# EasyEDA Pro project Lib.epro

# Board 提取库
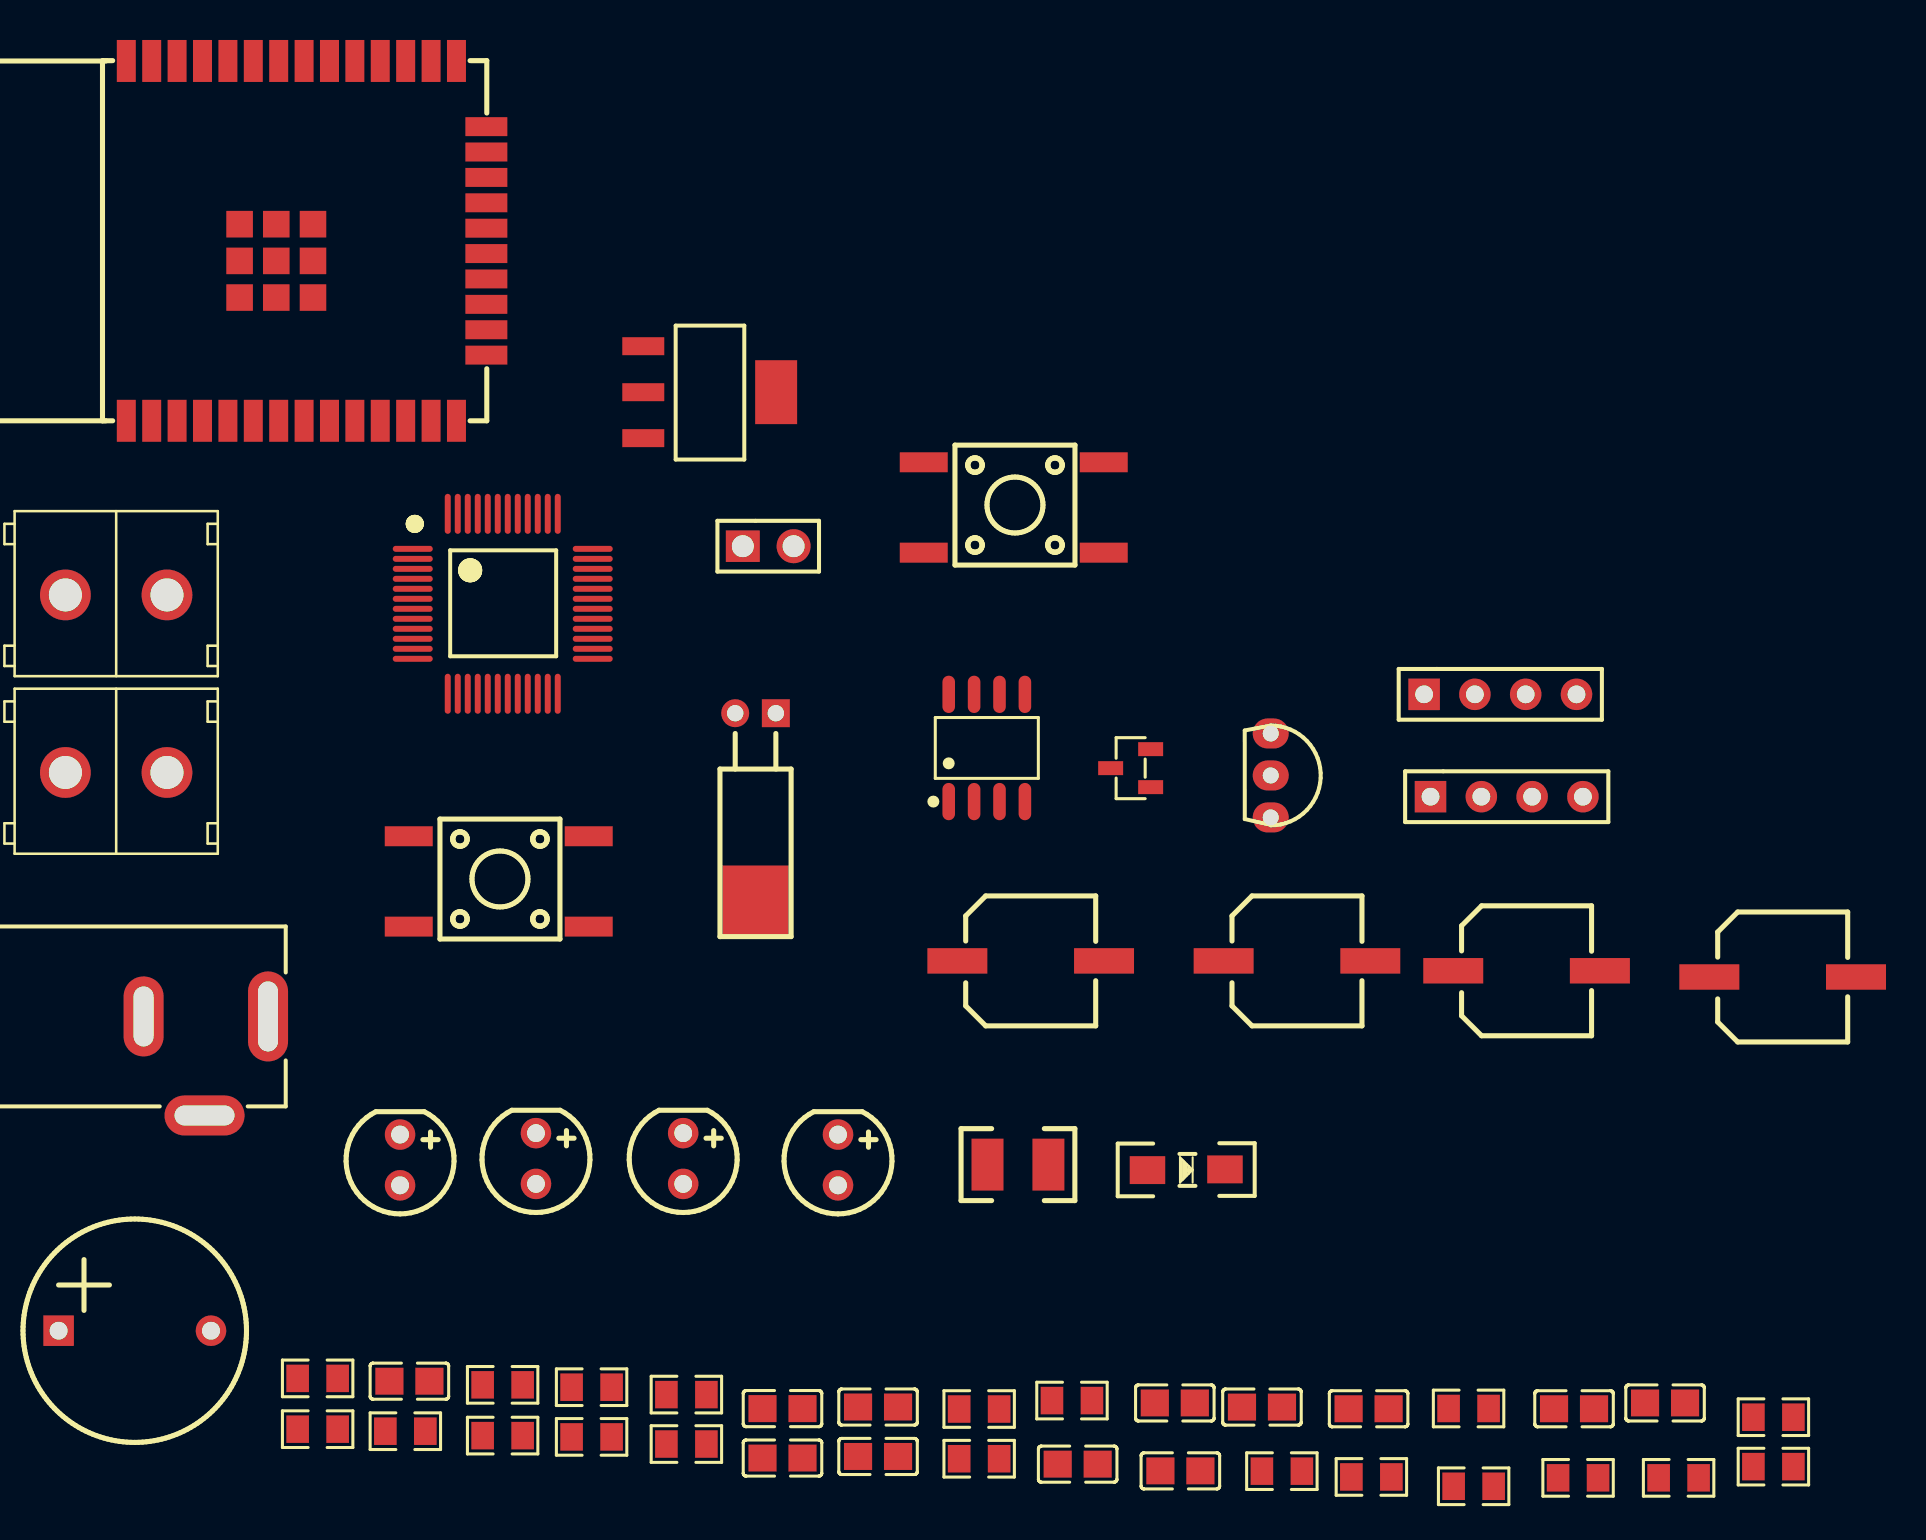
[diagram p0: board, top side]
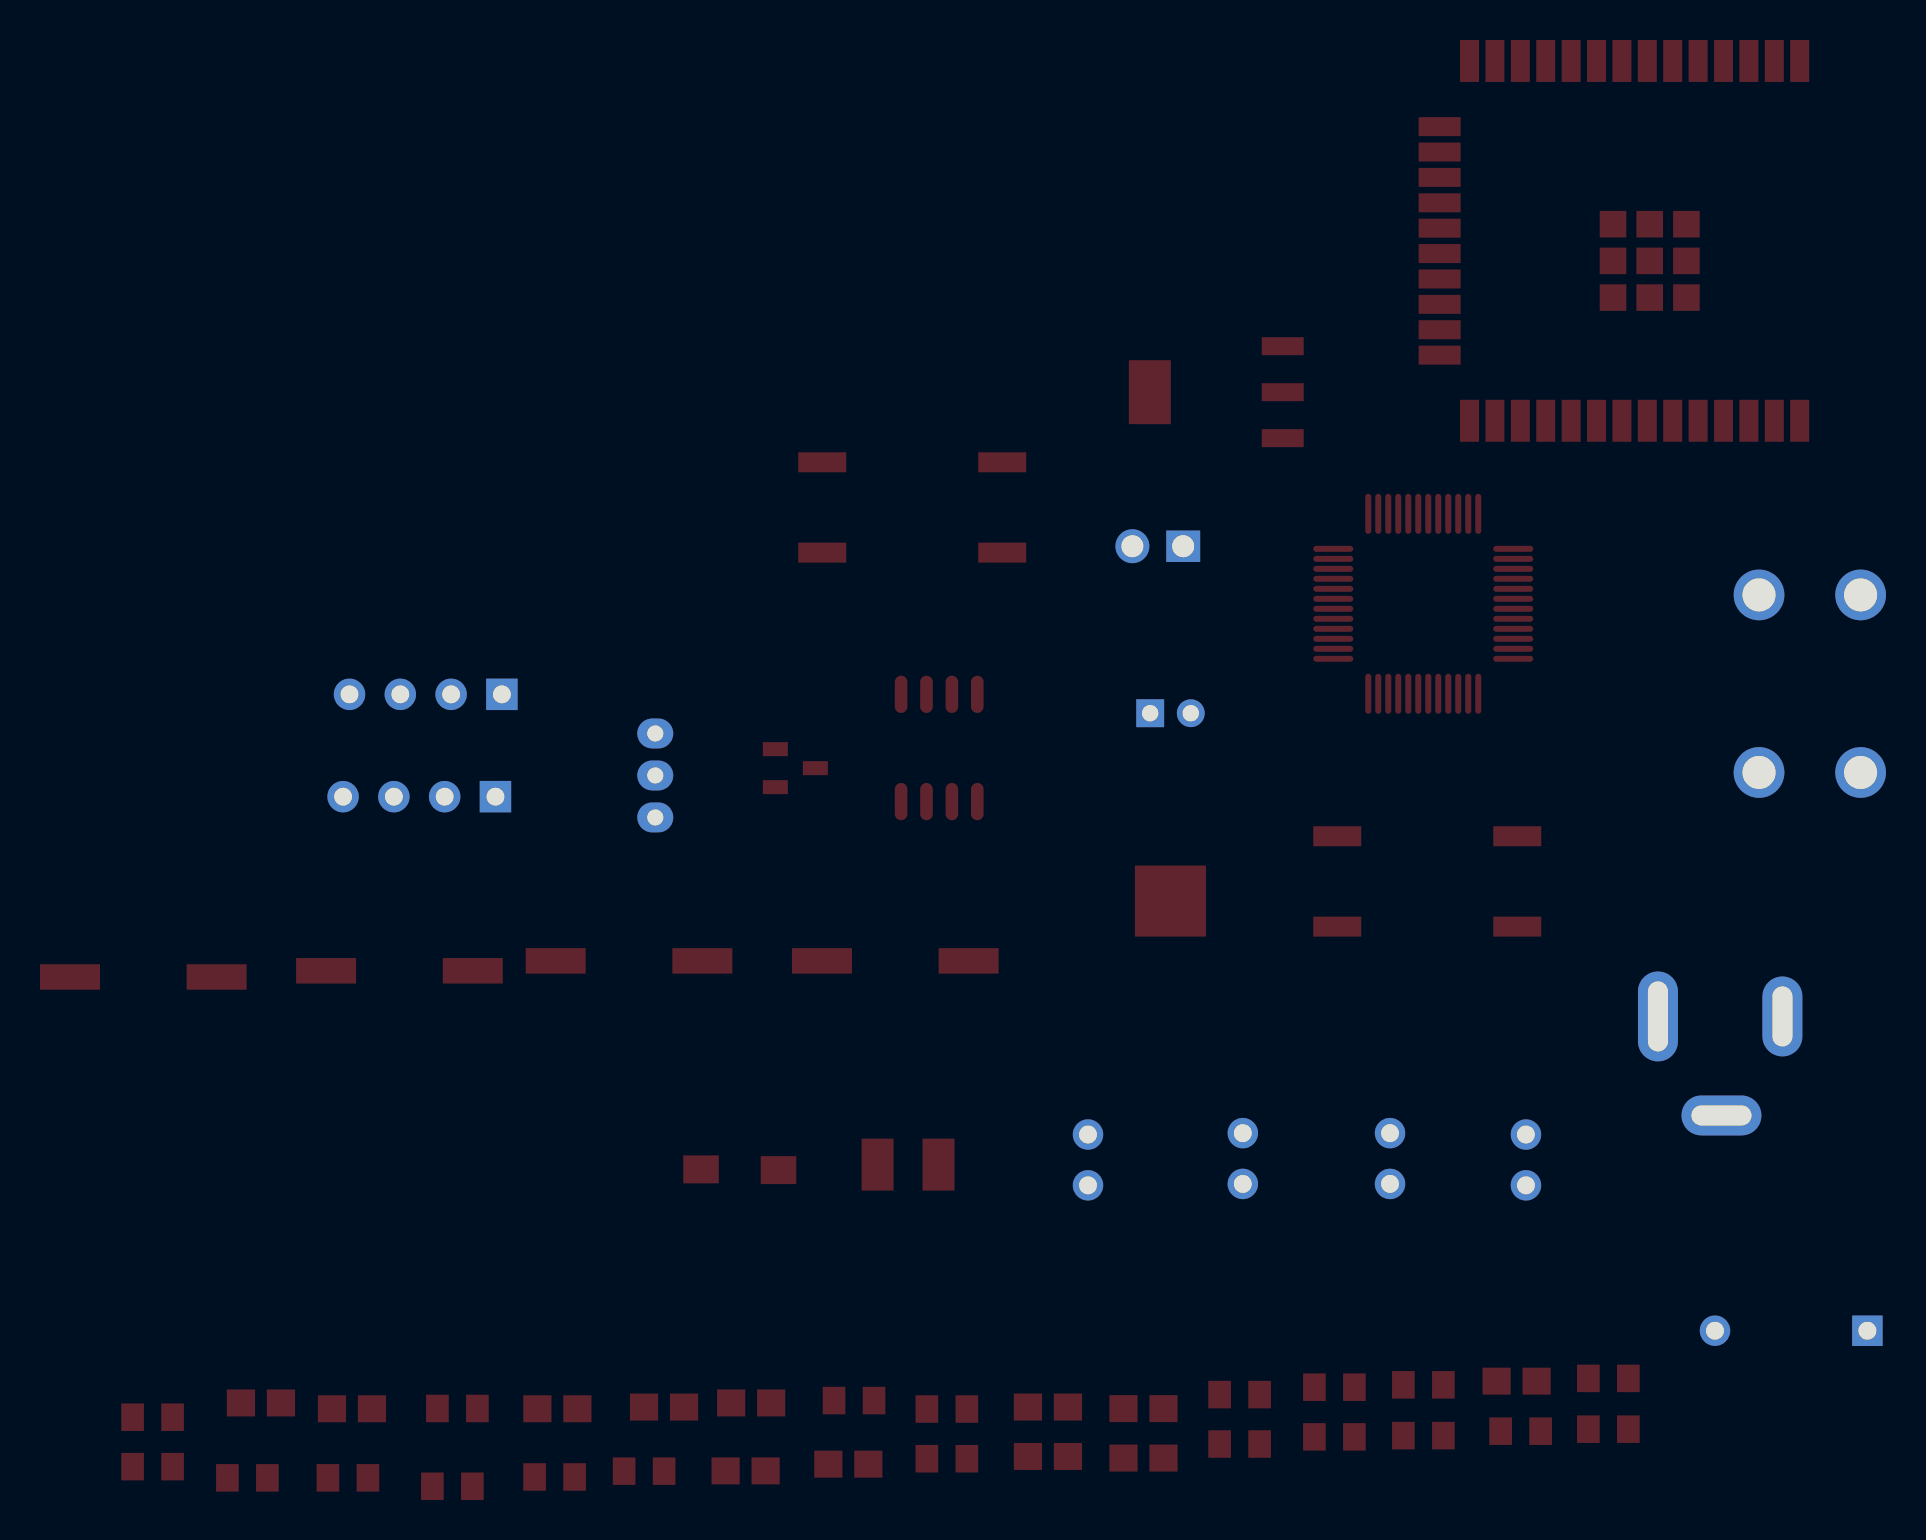
[diagram p1: board, bottom side, seen from below]

No outline. copper layers: Top Layer, Bottom Layer. Coordinates in mm from the lowest, leftmost part position.
Stack: Top Layer 0.035mm / Dielectric1 1.51mm FR4 er 4.5 / Bottom Layer 0.035mm

## Design rules (mm)
template: JLCPCB Capability(Two Layers Board)
spacing copperThickness1oz (default): track to track 0.102, other pairs 0.152 to 0.3
spacing copperThickness2oz: track to track 0.203, other pairs 0.152 to 0.3
track width copperThickness1oz (default): min 0.127, default 0.254, max 2.54
track width copperThickness2oz: min 0.203, default 0.254, max 2.54
differential pair differentialPair (default): width min 0.127, default 0.254, max 2.54; gap min 0.152, default 0.152
via viaSize (default): diameter min 0.5, default 0.61, max 10; hole min 0.3, default 0.305, max 6.3

## Placement (name value [footprint] x y rotation side)
BUZ1  BUZ1  [BUZZ]  0 7.78 0 top
C1  0.1uF  [C0805]  55.82 4.17 0 top
C2  1uF  [C0805]  50.96 1.11 0 top
C3  0.1uF  [C0805]  17.54 5.26 0 top
C4  0.1uF  [C0805]  65.51 3.88 0 top
C5  0.1uF  [C0805]  60.17 3.96 0 top
C6  0.1uF  [C0805]  36.2 3.88 0 top
C7  0.1uF  [C0805]  36.2 1.41 0 top
C8  0.1uF  [C0805]  40.98 3.96 0 top
C9  0.1uF  [C0805]  40.98 1.49 0 top
C10  0.1uF  [C0805]  80.33 4.17 0 top
C11  0.1uF  [C0805]  56.09 0.77 0 top
C12  0.1uF  [C0805]  75.78 3.88 0 top
CA1  100uF  [C_CAP-6*H]  69.74 25.79 0 top
CA2  100uF  [C_CAP-6*H]  44.94 26.28 0 top
CA3  22uF  [C_CAP-6*H]  58.26 26.28 0 top
CA4  22uF  [C_CAP-6*H]  82.55 25.48 0 top
CN1  S_PWR2.5  [PWR2.5]  4.38 23.63 0 top
CN2  DB128L-5.08-2P  [SIP2-5.08-A]  0.34 44.59 0 top
CN3  DB128L-5.08-2P  [SIP2-5.08-A]  0.34 35.71 0 top
D1  1N4007  [DIODE-0.8]  56.39 15.83 0 top
F1  ASMD1210-075  [R_R1210]  46.45 16.09 0 top
H1  HDR-M-2.54_1x2  [HDR-M-2.54_1X2]  35.48 47.02 0 top
H2  HDR-M-2.54_1x4  [HDR-M-2.54_1X4]  72.09 39.61 0 top
H3  HDR-M-2.54_1x4  [HDR-M-2.54_1X4]  72.41 34.49 0 top
LED1  LED-TH-3mm_R  [D_LED-5MM]  17.07 16.32 0 top
LED2  LED-TH-3mm_R  [D_LED-5MM]  23.87 16.39 0 top
LED3  LED-TH-3mm_R  [D_LED-5MM]  31.23 16.39 0 top
LED4  LED-TH-3mm_R  [D_LED-5MM]  38.97 16.32 0 top
PWR  6x6x6Plastic head  [SW-SMD_4P]  47.76 48.96 0 top
Q1  2N3904(SOT-23)  [SOT-23-3_L2.9-W1.3-P1.90-LS2.4-BR]  53.61 35.92 0 top
R1  510R  [R0805]  70.5 3.89 0 top
R2  10K  [R0805]  50.67 4.29 0 top
R3  100R  [R0805]  81.01 0.42 0 top
R4  100R  [R0805]  46.03 3.86 0 top
R5  NC  [R0805]  46.03 1.38 0 top
R6  10k  [R0805]  17.34 2.75 0 top
R7  1k  [R0805]  31.39 4.59 0 top
R8  1k  [R0805]  31.39 2.11 0 top
R9  5.1k  [R0805]  12.95 5.4 0 top
R10  1k  [R0805]  85.75 3.45 0 top
R11  5.1k  [R0805]  12.95 2.86 0 top
R12  1k  [R0805]  85.75 0.98 0 top
R13  5.1k  [R0805]  22.2 5.07 0 top
R14  5.1k  [R0805]  22.2 2.53 0 top
R15  5.1k  [R0805]  61.17 0.76 0 top
R16  510R  [R0805]  26.65 4.96 0 top
R17  510R  [R0805]  26.65 2.47 0 top
R18  1k  [R0805]  65.65 0.47 0 top
R19  10k  [R0805]  70.76 0 0 top
R20  10K  [R0805]  75.98 0.42 0 top
U1  AMS1117-3.3  [SOP-SOT-223]  29.24 57.03 0 top
U2  ESP32-WROOM-32E(16MB)  [ESP32-WROOM-32E]  12.39 62.3 0 top
U4  STC15W4K56S4  [QFP-LQFP-48]  17.71 46.89 0 top
U5  DS18B20+T&amp;R  [T092CS]  60.61 35.56 0 top
U6  DS1302SN  [SOP-8_L4.9-W3.9-P1.27-LS6.0-BL]  46.41 36.93 0 top
USR  6x6x6Plastic head  [SW-SMD_4P]  22.01 30.26 0 top
X1  32.768KHz  [XTAL-DT38]  35.87 38.67 0 top

## Footprints (pads in the part's own frame, mm; a bottom-side part is the same pattern mirrored in y, then rotated)
BUZZ
  rect 1.524x1.524 hole 0.894x0.889: 1(0,0)
  round 1.524 hole 0.894x0.889: 2(7.62,0)
C0805
  rect 1.41x1.35 smd: 1(-1,0) 2(1,0)
C_CAP-6*H
  rect 3x1.274 smd: 1(-0.001,0.001) 2(7.333,0.001)
D_LED-5MM
  round 1.524 hole 0.889x0.894: 1(0,1.27) 2(0,-1.27)
DIODE-0.8
  rect 1.778x1.397 smd: 1(-1.937,-0.018) 2(1.938,0.018)
ESP32-WROOM-32E
  rect 0.95x2.1 smd: 1(-9.002,-9) 2(-7.732,-9) 3(-6.463,-9) 4(-5.192,-9) 5(-3.922,-9) 6(-2.652,-9) 7(-1.383,-9) 8(-0.113,-9) 9(1.157,-9) 10(2.428,-9) 11(3.697,-9) 12(4.968,-9) 13(6.237,-9) 14(7.508,-9) 25(7.508,9) 26(6.237,9) 27(4.968,9) 28(3.697,9) 29(2.428,9) 30(1.157,9) 31(-0.113,9) 32(-1.383,9) 33(-2.652,9) 34(-3.922,9) 35(-5.192,9) 36(-6.463,9) 37(-7.732,9) 38(-9.002,9)
  rect 2.1x0.95 smd: 15(9.002,-5.715) 16(9.002,-4.444) 17(9.002,-3.175) 18(9.002,-1.905) 19(9.002,-0.634) 20(9.002,0.635) 21(9.002,1.905) 22(9.002,3.175) 23(9.002,4.446) 24(9.002,5.715)
  rect 1.33x1.33 smd: 39(-1.502,-1) 40(-1.502,-2.835) 41(-1.502,0.835) 42(-3.337,0.835) 43(-3.337,-1) 44(-3.337,-2.835) 45(0.333,-2.835) 46(0.333,-1) 47(0.333,0.835)
HDR-M-2.54_1X2
  rect 1.7x1.575 hole 1.1: 1(-1.27,0)
  round 1.7 hole 1.1: 2(1.27,0)
HDR-M-2.54_1X4
  rect 1.575x1.575 hole 0.889: 1(-3.81,0)
  round 1.575 hole 0.889: 2(-1.27,0) 3(1.27,0) 4(3.81,0)
PWR2.5
  oval 2x4.5 hole 1x3.5: 1(6.096,-0.127)
  oval 2x4 hole 1x3: 2(-0.127,-0.127)
  oval 4x2 hole 3x1: 3(2.921,-5.08)
QFP-LQFP-48
  oval 2x0.3 smd: 1(0,0) 2(0,-0.5) 3(0,-1) 4(0,-1.5) 5(0,-2) 6(0,-2.5) 7(0,-3) 8(0,-3.5) 9(0,-4) 10(0,-4.5) 11(0,-5) 12(0,-5.5) 25(9,-5.5) 26(9,-5) 27(9,-4.5) 28(9,-4) 29(9,-3.5) 30(9,-3) 31(9,-2.5) 32(9,-2) 33(9,-1.5) 34(9,-1) 35(9,-0.5) 36(9,0)
  oval 0.3x2 smd: 13(1.75,-7.25) 14(2.25,-7.25) 15(2.75,-7.25) 16(3.25,-7.25) 17(3.75,-7.25) 18(4.25,-7.25) 19(4.75,-7.25) 20(5.25,-7.25) 21(5.75,-7.25) 22(6.25,-7.25) 23(6.75,-7.25) 24(7.25,-7.25) 37(7.25,1.75) 38(6.75,1.75) 39(6.25,1.75) 40(5.75,1.75) 41(5.25,1.75) 42(4.75,1.75) 43(4.25,1.75) 44(3.75,1.75) 45(3.25,1.75) 46(2.75,1.75) 47(2.25,1.75) 48(1.75,1.75)
R0805
  rect 1.133x1.377 smd: 1(-1,0) 2(1,0)
R_R1210
  rect 1.6x2.6 smd: 1(0,0) 2(3.048,0)
SIP2-5.08-A
  round 2.54 hole 1.651: 1(0,0) 2(5.08,0)
SOP-8_L4.9-W3.9-P1.27-LS6.0-BL
  oval 0.63x1.865 smd: 1(-1.905,-2.683) 2(-0.635,-2.683) 3(0.635,-2.683) 4(1.905,-2.683) 5(1.905,2.683) 6(0.635,2.683) 7(-0.635,2.683) 8(-1.905,2.683)
SOP-SOT-223
  rect 2.1x0.9 smd: 1(0,0) 2(0,-2.3) 3(0,-4.6)
  rect 2.1x3.2 smd: 4(6.644,-2.3)
SOT-23-3_L2.9-W1.3-P1.90-LS2.4-BR
  rect 1.25x0.7 smd: 1(1,-0.95) 2(1,0.95) 3(-1,0)
SW-SMD_4P
  rect 2.4x1 smd: 1(-4.5,2.26) 2(-4.5,-2.26) 3(4.5,-2.26) 4(4.5,2.26)
T092CS
  oval 1.8x1.5 hole 0.8: 1(0,-2.1) 2(0,0) 3(0,2.1)
XTAL-DT38
  rect 3.556x3.556 smd: 0(-1.016,-9.398)
  rect 1.397x1.397 hole 0.818x0.813: 1(0,0)
  round 1.397 hole 0.818x0.813: 2(-2.032,0)

## Nets
3.3V_MCU: BUZ1.1 C5.2 C11.2 C12.2 CA3.1 H3.3 R9.1 R11.1 R13.1 R14.1 R15.2 R20.2 U4.15 U5.3 U6.1
3.3V_WIFI: C1.2 C3.2 CA1.1 R2.1 U1.2 U1.4 U2.2
+5V0: C4.2 CA2.1 CA4.1 D1.1 F1.2 R1.2 R6.1 U1.3
GND: C1.1 C2.2 C3.1 C4.1 C5.1 C6.1 C7.1 C8.1 C9.1 C10.2 C11.1 C12.1 CA1.2 CA2.2 CA3.2 CA4.2 CN1.2 CN1.3 D1.2 H3.4 PWR.3 PWR.4 Q1.1 R1.1 R5.2 R19.1 U1.1 U2.1 U2.15 U2.38 U2.39 U4.17 U5.1 U6.4 USR.1 USR.2
CONTROL_EXT: R18.2 U4.24
DQ: R20.1 U4.16 U5.2
EN_WI-FI: C2.1 R2.2 U2.3 U4.8
ESP32_TCK: H2.2 U2.16
ESP32_TDI: H2.3 U2.14
ESP32_TDO: H2.1 U2.23
ESP32_TMS: H2.4 U2.13
MCU_AIN1: C6.2 R7.1 U4.10
MCU_AIN2: C7.2 R8.1 U4.11
MCU_AIN3: C8.2 R10.1 U4.12
MCU_AIN4: C9.2 R12.1 U4.13
MCU_PWR_EN: PWR.1 PWR.2 R6.2
RTC_IO: U4.30 U6.6
RTC_RST: U4.29 U6.5
RTC_SCLK: U4.18 U6.7
USR: C10.1 R15.1 U4.33 USR.3 USR.4
WI-FI_RXD: R4.2 U4.6
WI-FI_TXD: R3.2 U4.5
$1N157: R4.1 U2.27
$1N158: R3.1 U2.28
$1N183: H1.2 U2.34
$1N184: H1.1 U2.35
$1N223: R5.1 U2.25
$1N393: CN2.1 R7.2
$1N403: CN2.2 R8.2
$1N404: CN3.1 R10.2
$1N405: CN3.2 R12.2
$1N495: CN1.1 F1.1
$1N538: R16.1 U4.19
$1N539: H3.1 R16.2
$1N549: R17.1 U4.20
$1N550: H3.2 R17.2
$1N579: LED1.1 R9.2
$1N580: LED1.2 U4.43
$1N581: LED2.1 R11.2
$1N601: LED3.1 R13.2
$1N621: LED4.1 R14.2
$1N641: LED3.2 U4.45
$1N642: LED4.2 U4.46
$1N643: LED2.2 U4.44
$1N748: Q1.2 R18.1 R19.2
$1N768: BUZ1.2 Q1.3
$1N806: U6.2 X1.2
$1N807: U6.3 X1.1

Pads without a net: U2 4 5 6 7 8 9 10 11 12 17 18 19 20 21 22 24 26 29 30 31 32 33 36 37 40 41 42 43 44 45 46 47; U4 1 2 3 4 7 9 14 21 22 23 25 26 27 28 31 32 34 35 36 37 38 39 40 41 42 47 48; U6 8; X1 0
